# EAGLE design musicpulse (EAGLE 9.1.3)
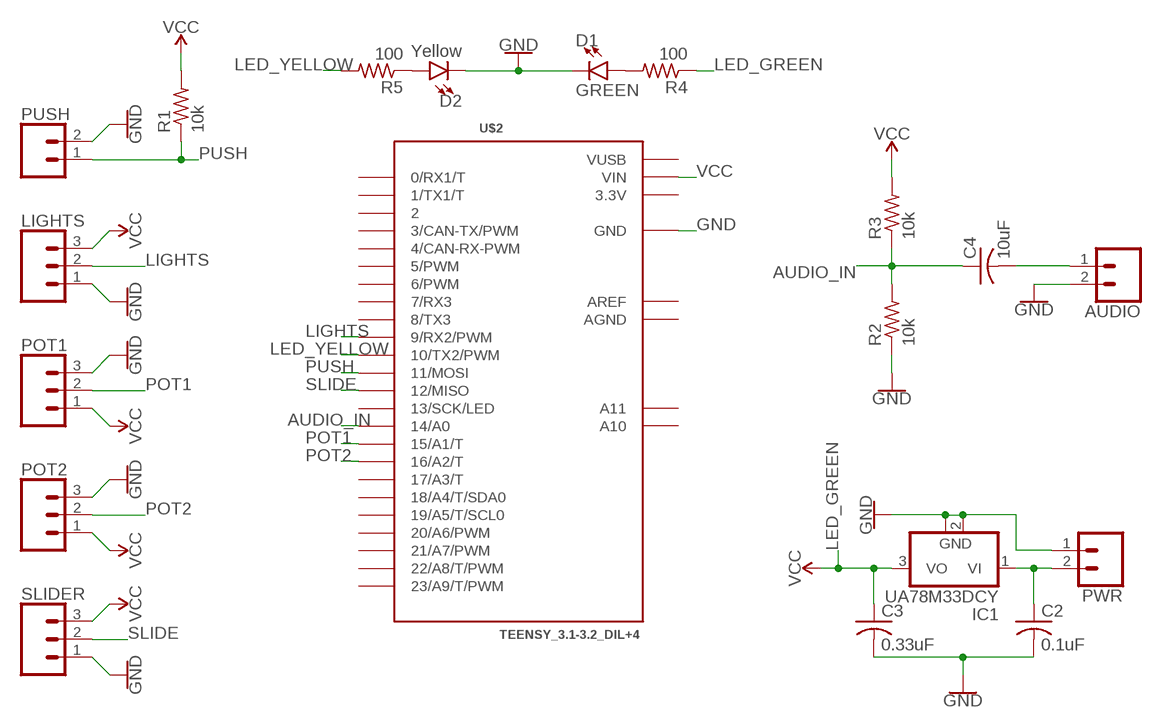
[diagram p0: schematic, sheet 1]

## Parts
AUDIO  CONN_02  [1X02]
C2  0.1uF  C-USC1206  [C1206]
C3  0.33uF  C-USC1206  [C1206]
C4  10uF  C-USC1206  [C1206]
D1  GREEN  LED-GREEN1206  [LED-1206]
D2  Yellow  LED-YELLOWLILYPAD  [LED-1206]
IC1  UA78M33DCY  [SOT223]
LIGHTS  CONN_03  [1X03]
POT1  CONN_03  [1X03]
POT2  CONN_03  [1X03]
PUSH  CONN_02  [1X02]
PWR  CONN_02  [1X02]
R1  10k  R-US_R1206  [R1206]
R2  10k  R-US_R1206  [R1206]
R3  10k  R-US_R1206  [R1206]
R4  100  R-US_R1206  [R1206]
R5  100  R-US_R1206  [R1206]
SLIDER  CONN_03  [1X03]
U$2  TEENSY_3.1-3.2_DIL+4  [TEENSY_3.0-3.2&LC_DIL+4]

## Nets
AUDIO_IN: C4.1 R2.2 R3.1 U$2.14/A0
GND: AUDIO.2 C2.2 C3.2 D1.C D2.C IC1.2(GND) IC1.4(GND) LIGHTS.1 POT1.3 POT2.3 PUSH.2 PWR.1 R2.1 SLIDER.1 U$2.GND
LED_GREEN: C3.1 IC1.3(VO) R4.1 ; supply symbol labelled VCC
LED_YELLOW: R5.2 U$2.10(10/TX2/PWM)
LIGHTS: LIGHTS.2 U$2.9(9/RX2/PWM)
N$1: C2.1 IC1.1(VI) PWR.2
N$2: D1.A R4.2
N$3: R1.2 ; supply symbol labelled VCC
N$4: D2.A R5.1
N$5: AUDIO.1 C4.2
POT1: POT1.2 U$2.15/A1(15/A1/T)
POT2: POT2.2 U$2.16/A2(16/A2/T)
PUSH: PUSH.1 R1.1 U$2.11(11/MOSI)
SLIDE: SLIDER.2 U$2.12(12/MISO)
VCC: LIGHTS.3 POT1.1 POT2.1 R3.2 SLIDER.3 U$2.VIN
Unconnected: U$2.0(0/RX1/T) U$2.1(1/TX1/T) U$2.2 U$2.3(3/CAN-TX/PWM) U$2.4(4/CAN-RX-PWM) U$2.5(5/PWM) U$2.6(6/PWM) U$2.7(7/RX3) U$2.8(8/TX3) U$2.13(13/SCK/LED) U$2.17/A3(17/A3/T) U$2.18/A4(18/A4/T/SDA0) U$2.19/A5(19/A5/T/SCL0) U$2.20/A6(20/A6/PWM) U$2.21/A7(21/A7/PWM) U$2.22/A8(22/A8/T/PWM) U$2.23/A9(23/A9/T/PWM) U$2.A10 U$2.A11

## Power pins joined to a net without a drawn wire
3.3V: U$2.3.3V
AGND: U$2.AGND
AREF: U$2.AREF
VUSB: U$2.VUSB

## Library data of the parts
AUDIO PUSH PWR = SparkFun-Connectors:CONN_02: Multi connection point. Often used as Generic Header-pin footprint for 0.1 inch spaced/style header connections On any of the 0.1 inch spaced packages, you can populate with these: Break Away Headers - Straight <https://www.sparkfun.com/products/116> (PRT-00116) Break Away Male Headers - Right Angle <https://www.sparkfun.com/products/553> (PRT-00553) Female Headers <https://www.sparkfun.com/products/115> (PRT-00115) Break Away Headers - Machine Pin <https://www.sparkfun.com/products/117> (PRT-00117) Break Away Female Headers - Swiss Machine Pin <https://www.sparkfun.com/products/743> (PRT-00743) For SCREWTERMINALS and SPRING TERMINALS visit here: Screw Terimnals on SparkFun.com <https://www.sparkfun.com/search/results?term=Screw+Terminals> (5mm/3.5mm/2.54mm spacing) This device is also useful as a general connection point to wire up your design to another part of your project. Our various solder wires solder well into these plated through hole pads. Hook-Up Wire - Assortment (Stranded, 22 AWG) <https://www.sparkfun.com/products/11375> (PRT-11375) Hook-Up Wire - Assortment (Solid Core, 22 AWG) <https://www.sparkfun.com/products/11367> (PRT-11367) View the entire wire category on our website here <https://www.sparkfun.com/categories/141> Special notes: Molex polarized connector foot print use with: PRT-08233 with associated crimp pins and housings. 2.54_SCREWTERM for use with PRT-10571. 3.5mm Screw Terminal footprints for PRT-08084 5mm Screw Terminal footprints for use with PRT-08432
C2-C4 = BeagleBone_Black_Wireless:C-US: CAPACITOR, American symbol
D1 = SparkFun-LED:LED-GREEN: Green SMD LED Used in manufacturing of various products at SparkFun Packages: 0603 - SMD 0603 package [Product Link] <http://www.futureelectronics.com/en/technologies/semiconductors/optoelectronics/leds/Pages/9894312-LTST-C190GKT.aspx?CrossPart=HSMG-C190&IM=0> LilyPad 1206 - SMD1206 LilyPad package [Product Link] <http://www.futureelectronics.com/en/Technologies/Product.aspx?ProductID=IN150NGHARVATEKCORPORATION2049943&IM=0> 1206 - SMD1206 package [Product Link] <http://www.futureelectronics.com/en/technologies/semiconductors/optoelectronics/leds/Pages/8315665-LTST-C150KGKT.aspx?IM=0> 1206 Bottom Mount -SMD 1206 Bottom Mount [Product Link] <http://www.digikey.com/product-detail/en/lite-on-inc/LTST-C230KGKT/160-1456-1-ND/386854> SparkFun Products: Pro Mini 328 -5V <https://www.sparkfun.com/products/821> RedBoard <https://www.sparkfun.com/products/12757> MP3 Trigger <https://www.sparkfun.com/products/13720> Makey Makey <https://www.sparkfun.com/products/11076>; PROD_ID: DIO-00862
D2 = SparkFun-LED:LED-YELLOW: Yellow SMD LED Used in manufacturing several products at SparkFun. Packages: 0603 - SMD 0603 package[Product Link] <http://www.kingbrightusa.com/product.asp?catalog_name=LED&product_id=APT1608SYCK> 0603 -SMART - SMART SMD 0603 package (more efficient/more expensive) [Product Link] <http://www.osram-os.com/osram_os/en/products/product-catalog/led-light-emitting-diodes/smartled-0603/ly-l29k/index.jsp> LilyPad - SMD1206 package[Product Datasheet] <https://www.sparkfun.com/datasheets/DevTools/LilyPad/Q150YUS4.pdf> SparkFun Products: Blynk Board <https://www.sparkfun.com/products/13794> IOIO-OTG <https://www.sparkfun.com/products/13613> XBee Explorer Serial <https://www.sparkfun.com/products/13225>; PROD_ID: DIO-09909
IC1 = linear:UA78M*: POSITIVE-VOLTAGE REGULATORS Source: http://focus.ti.com/lit/ds/symlink/ua78m33.pdf
LIGHTS POT1 POT2 SLIDER = SparkFun-Connectors:CONN_03: Multi connection point. Often used as Generic Header-pin footprint for 0.1 inch spaced/style header connections On any of the 0.1 inch spaced packages, you can populate with these: Break Away Headers - Straight <https://www.sparkfun.com/products/116> (PRT-00116) Break Away Male Headers - Right Angle <https://www.sparkfun.com/products/553> (PRT-00553) Female Headers <https://www.sparkfun.com/products/115> (PRT-00115) Break Away Headers - Machine Pin <https://www.sparkfun.com/products/117> (PRT-00117) Break Away Female Headers - Swiss Machine Pin <https://www.sparkfun.com/products/743> (PRT-00743) Stackable Header - 3 Pin (Female, 0.1") <https://www.sparkfun.com/products/13875> (PRT-13875) For SCREWTERMINALS and SPRING TERMINALS visit here: Screw Terimnals on SparkFun.com <https://www.sparkfun.com/search/results?term=Screw+Terminals> (5mm/3.5mm/2.54mm spacing) This device is also useful as a general connection point to wire up your design to another part of your project. Our various solder wires solder well into these plated through hole pads. Hook-Up Wire - Assortment (Stranded, 22 AWG) <https://www.sparkfun.com/products/11375> (PRT-11375) Hook-Up Wire - Assortment (Solid Core, 22 AWG) <https://www.sparkfun.com/products/11367> (PRT-11367) View the entire wire category on our website here <https://www.sparkfun.com/categories/141> Special notes: Molex polarized connector foot print use with SKU : PRT-08232 with associated crimp pins and housings.
R1-R5 = BeagleBone_Black_Wireless:R-US_: RESISTOR, American symbol
U$2 = Teensy_3_and_LC_Series_Boards_v1.4:TEENSY_3.1-3.2_DIL+4: Teensy 3.1 and 3.2 in a DIL package with the inner 4 pins

## Net classes
0 default: width 0.305 mm, drill 0.508 mm, clearance 0.254 mm

## Board
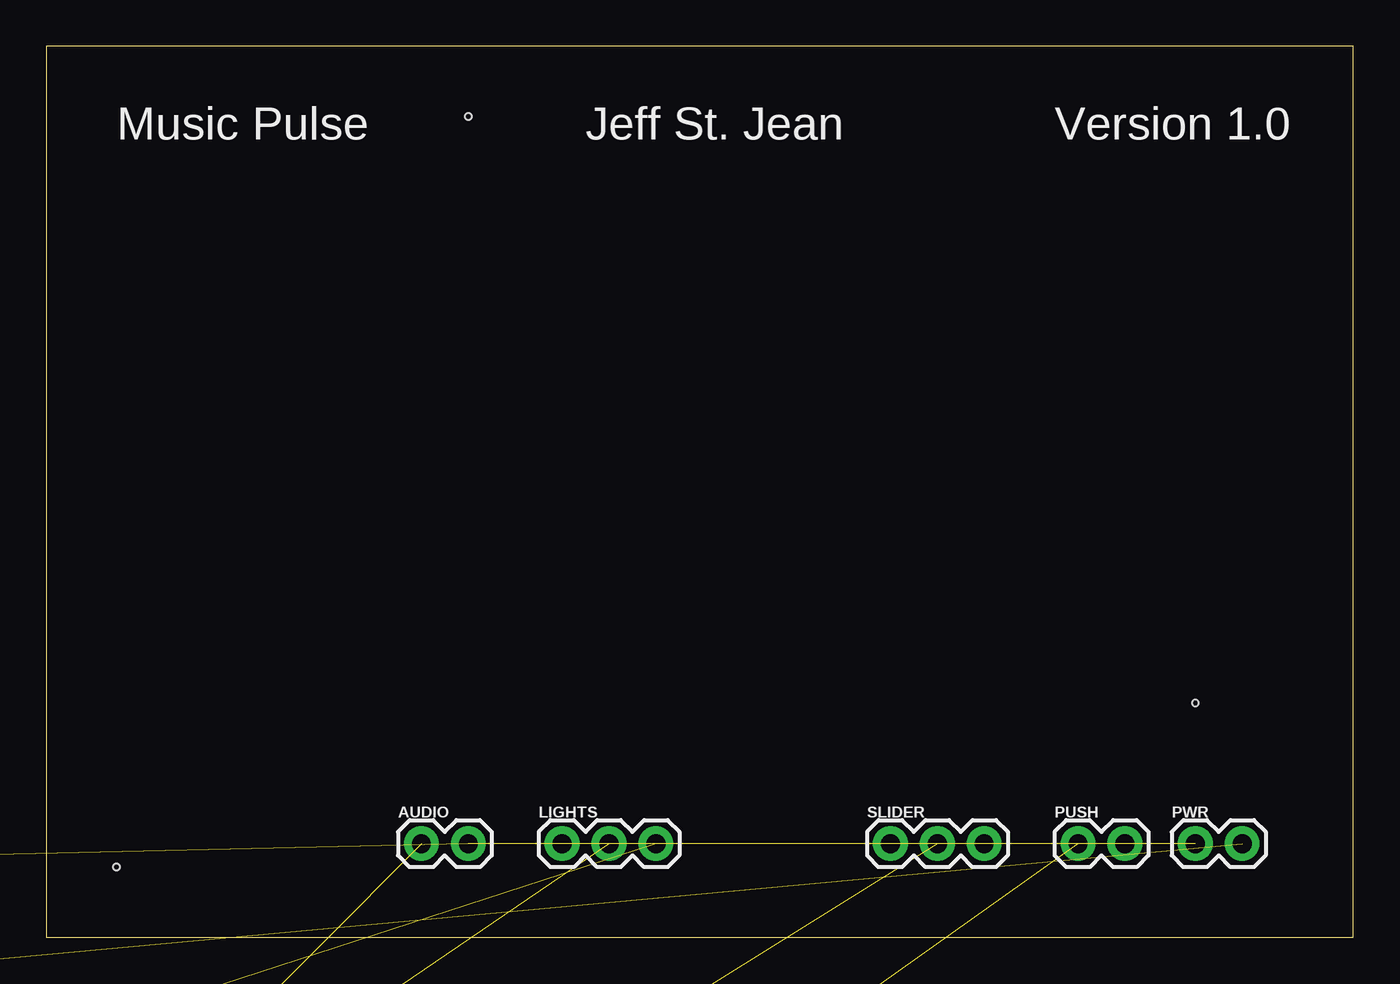
[diagram p1: board, top side]
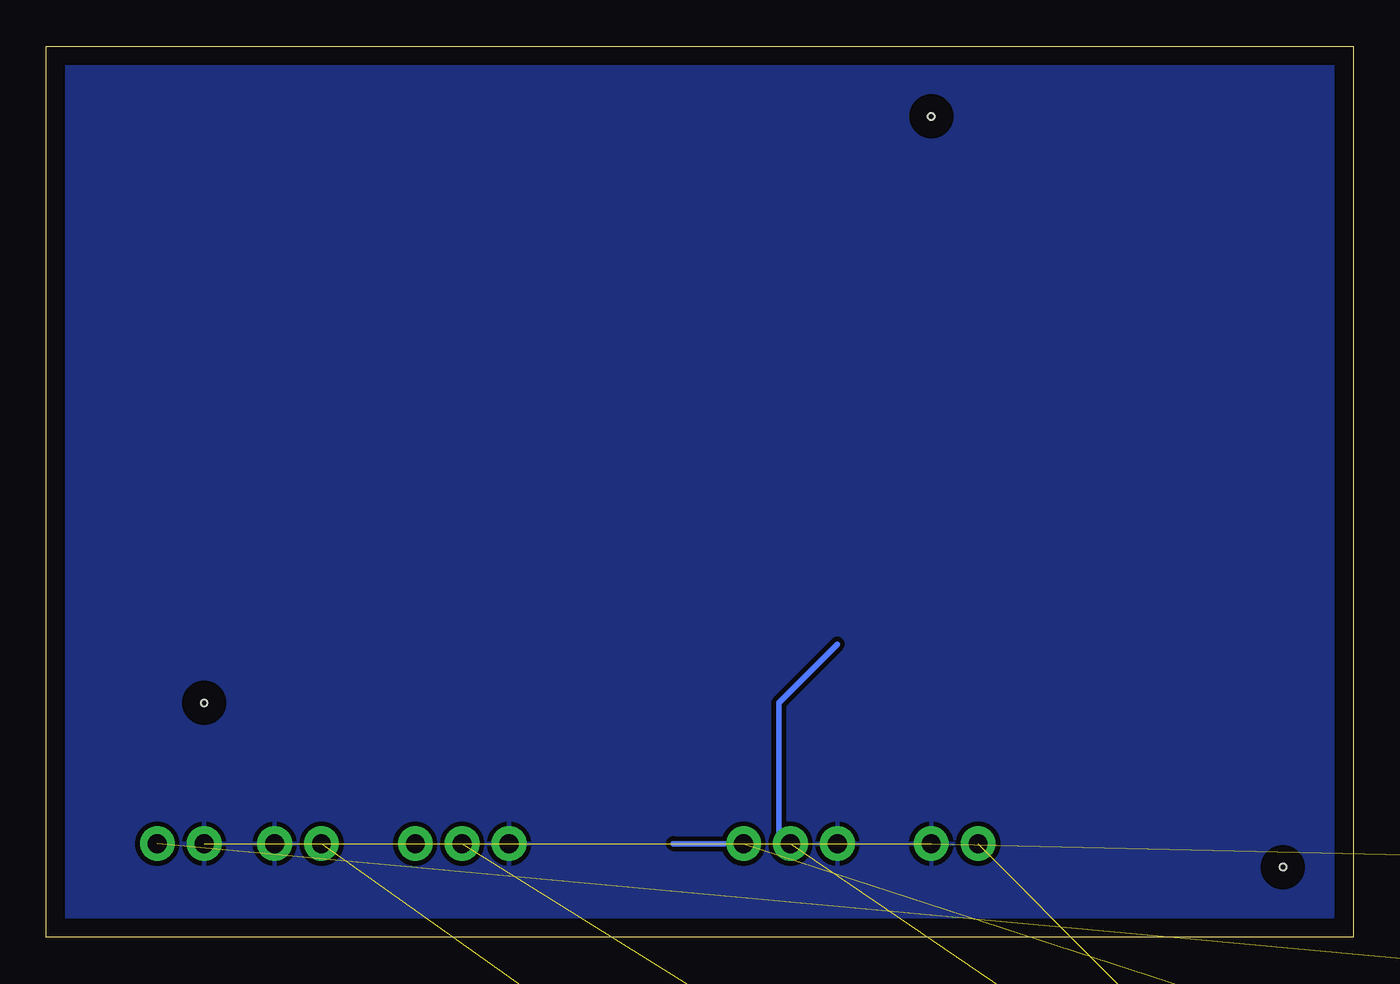
[diagram p2: board, bottom side, seen from below]

Size 70.79 x 48.25 mm. Coordinates in mm from the lower left corner, seen from the top.
Outline: 0,0 70.79,0 70.79,48.25 0,48.25 0,0
Copper layers (1*16): Top 0.035mm / dielectric 1.5mm / Bottom 0.035mm
Design rules "default": minimum track width 6mil, minimum drill 0.35mm, track to track 6mil, track to pad 6mil, pad to pad 6mil, via to via 6mil, smd to smd 6mil, copper to edge 40mil, drill to drill 6mil, minimum pad ring 10mil, minimum via ring 8mil, stop-mask expansion 4mil, vias tented up to drill 0mil, thermal gap 10mil
Holes 0.35 mm at 3.81,3.81 62.23,12.7 22.86,44.45

### Footprints (pad centres in the part's own frame; a part is rotated, then mirrored left to right if it is on the bottom)
1X02 = drill 1.016 pad 1.88: 1 0,0; 2 2.54,0
C1206 = smd 1.6 x 1.8: 1 -1.4,0; 2 1.4,0
LED-1206 = smd 1.2 x 1.4: A -1.5,0; C 1.5,0
SOT223 = smd 1.219 x 2.235: 1 -2.311,-3.099; 2 0,-3.099; 3 2.311,-3.099 | smd 3.6 x 2.2: 4 0,3.099
1X03 = drill 1.016 pad 1.88: 1 0,0; 2 2.54,0; 3 5.08,0
R1206 = smd 1.6 x 1.803: 1 -1.422,0; 2 1.422,0
TEENSY_3.0-3.2&LC_DIL+4 = drill 0.965: 0 -7.62,13.97; 1 -7.62,11.43; 2 -7.62,8.89; 3 -7.62,6.35; 3.3V 7.62,11.43; 4 -7.62,3.81; 5 -7.62,1.27; 6 -7.62,-1.27; 7 -7.62,-3.81; 8 -7.62,-6.35; 9 -7.62,-8.89; 10 -7.62,-11.43; 11 -7.62,-13.97; 12 -7.62,-16.51; 13 7.62,-16.51; 14/A0 7.62,-13.97; 15/A1 7.62,-11.43; 16/A2 7.62,-8.89; 17/A3 7.62,-6.35; 18/A4 7.62,-3.81; 19/A5 7.62,-1.27; 20/A6 7.62,1.27; 21/A7 7.62,3.81; 22/A8 7.62,6.35; 23/A9 7.62,8.89; A10 5.08,6.35; A11 5.08,3.81; AGND 7.62,13.97; AREF 5.08,8.89; GND -7.62,16.51; VIN 7.62,16.51; VUSB 5.08,13.97

### Placement (x,y rotation side)
AUDIO  20.32,5.08 0 top
C2  -8.89,-16.51 0 top  (outside the outline)
C3  -8.89,-11.43 0 top  (outside the outline)
C4  -8.89,-22.86 0 top  (outside the outline)
D1  -27.94,-46.99 0 top  (outside the outline)
D2  -27.94,-50.8 0 top  (outside the outline)
IC1  -7.62,1.27 0 top  (outside the outline)
LIGHTS  27.94,5.08 0 top
POT1  -27.94,-68.58 0 top  (outside the outline)
POT2  -27.94,-72.39 0 top  (outside the outline)
PUSH  55.88,5.08 0 top
PWR  62.23,5.08 0 top
R1  -8.89,-41.91 0 top  (outside the outline)
R2  -8.89,-29.21 0 top  (outside the outline)
R3  -8.89,-35.56 0 top  (outside the outline)
R4  -27.94,-55.88 0 top  (outside the outline)
R5  -27.94,-62.23 0 top  (outside the outline)
SLIDER  45.72,5.08 0 top
U$2  -21.59,-26.67 0 top  (outside the outline)

### Tracks (layer width: path | path; a pad name or v marks a point on that pad's centre or on a via)
AUDIO_IN  (3 unrouted)
GND  (14 unrouted)
  pour Bottom: -2.54,49.53 -2.54,-3.81 74.93,-3.81 74.93,49.53
LED_GREEN  (2 unrouted)
LED_YELLOW  (1 unrouted)
LIGHTS  (1 unrouted)
  Bottom 0.305: 27.94,15.88 31.11,12.7 31.11,5.71 LIGHTS.2
N$1  (2 unrouted)
N$2  (1 unrouted)
N$4  (1 unrouted)
N$5  (1 unrouted)
POT1  (1 unrouted)
POT2  (1 unrouted)
PUSH  (2 unrouted)
SLIDE  (1 unrouted)
VCC  (5 unrouted)
  Bottom 0.305: 36.83,5.08 LIGHTS.3

### Text on the board
tPlace: Music Pulse | Jeff St. Jean | Version 1.0